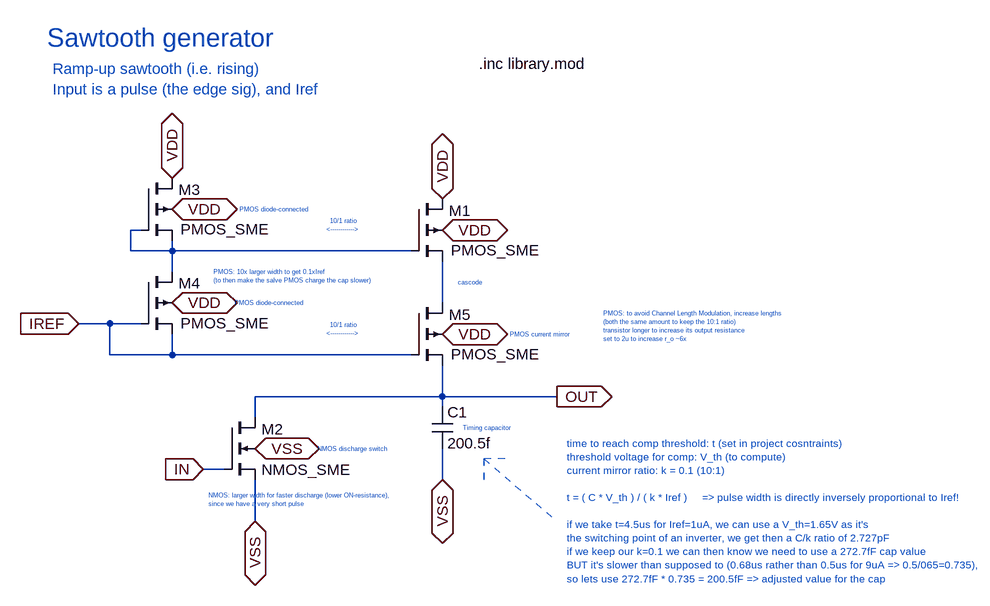
[diagram p0: schematic my_sawtooth_gen.bk2.asc]
my_sawtooth_gen.bk2.asc, the LTspice schematic file:
Version 4.1
SHEET 1 1580 1548
WIRE 48 208 32 208
WIRE 32 240 32 208
WIRE 96 240 96 224
WIRE 96 240 32 240
WIRE 464 240 96 240
WIRE 96 272 96 240
WIRE 512 320 512 256
WIRE 0 352 -48 352
WIRE 48 352 0 352
WIRE 0 400 0 352
WIRE 96 400 96 368
WIRE 96 400 0 400
WIRE 464 400 96 400
WIRE 512 464 512 416
WIRE 512 464 224 464
WIRE 688 464 512 464
WIRE 512 480 512 464
WIRE 224 496 224 464
WIRE 176 576 144 576
WIRE 512 592 512 544
WIRE 224 656 224 592
FLAG 144 576 IN
IOPIN 144 576 In
FLAG -48 352 IREF
IOPIN -48 352 In
FLAG 688 464 OUT
IOPIN 688 464 Out
FLAG 96 320 VDD
IOPIN 96 320 BiDir
FLAG 512 208 VDD
IOPIN 512 208 BiDir
FLAG 512 592 VSS
IOPIN 512 592 BiDir
FLAG 224 656 VSS
IOPIN 224 656 BiDir
FLAG 224 544 VSS
IOPIN 224 544 BiDir
FLAG 96 176 VDD
IOPIN 96 176 BiDir
FLAG 512 368 VDD
IOPIN 512 368 BiDir
FLAG 512 160 VDD
IOPIN 512 160 BiDir
FLAG 96 128 VDD
IOPIN 96 128 BiDir
SYMBOL pmos4 464 160 R0
WINDOW 0 58 18 Left 2
WINDOW 3 61 79 Left 2
SYMATTR InstName M1
SYMATTR Value PMOS_SME
SYMATTR Value2 l=5u w=1u
SYMBOL cap 496 480 R0
SYMATTR InstName C1
SYMATTR Value 200.5f
SYMBOL nmos4 176 496 R0
WINDOW 0 58 18 Left 2
WINDOW 3 58 81 Left 2
SYMATTR InstName M2
SYMATTR Value NMOS_SME
SYMATTR Value2 l=0.35u w=1.8u
SYMBOL pmos4 48 128 R0
WINDOW 0 58 18 Left 2
WINDOW 3 61 79 Left 2
SYMATTR InstName M3
SYMATTR Value PMOS_SME
SYMATTR Value2 l=5u w=10u
SYMBOL pmos4 48 272 R0
WINDOW 0 58 18 Left 2
WINDOW 3 61 79 Left 2
SYMATTR InstName M4
SYMATTR Value PMOS_SME
SYMATTR Value2 l=5u w=10u
SYMBOL pmos4 464 320 R0
WINDOW 0 58 18 Left 2
WINDOW 3 61 79 Left 2
SYMATTR InstName M5
SYMATTR Value PMOS_SME
SYMATTR Value2 l=5u w=1u
TEXT -96 -88 Left 4 ;Sawtooth generator
TEXT -88 -40 Left 2 ;Ramp-up sawtooth (i.e. rising)\nInput is a pulse (the edge sig), and Iref
TEXT 616 368 Left 0 ;PMOS current mirror
TEXT 544 512 Left 0 ;Timing capacitor
TEXT 320 544 Left 0 ;NMOS discharge switch
TEXT 192 320 Left 0 ;PMOS diode-connected
TEXT 568 -48 Left 2 !.inc library.mod
TEXT 152 616 Left 0 ;NMOS: larger width for faster discharge (lower ON-resistance),\nsince we have a very short pulse
TEXT 160 272 Left 0 ;PMOS: 10x larger width to get 0.1xIref\n(to then make the salve PMOS charge the cap slower)
TEXT 760 336 Left 0 ;PMOS: to avoid Channel Length Modulation, increase lengths\n(both the same amount to keep the 10:1 ratio)\ntransistor longer to increase its output resistance\nset to 2u to increase r_o ~6x
TEXT 704 536 Left 1 ;time to reach comp threshold: t (set in project cosntraints)\nthreshold voltage for comp: V_th (to compute)\ncurrent mirror ratio: k = 0.1 (10:1)\n \nt = ( C * V_th ) / ( k * Iref )     => pulse width is directly inversely proportional to Iref!\n \nif we take t=4.5us for Iref=1uA, we can use a V_th=1.65V as it's\nthe switching point of an inverter, we get then a C/k ratio of 2.727pF\nif we keep our k=0.1 we can then know we need to use a 272.7fF cap value\nBUT it's slower than supposed to (0.68us rather than 0.5us for 9uA => 0.5/065=0.735),\nso lets use 272.7fF * 0.735 = 200.5fF => adjusted value for the cap
TEXT 360 200 Center 0 ;10/1 ratio\n<------------>
TEXT 200 176 Left 0 ;PMOS diode-connected
TEXT 360 360 Center 0 ;10/1 ratio\n<------------>
TEXT 536 288 Left 0 ;cascode
LINE Normal 576 560 688 656 1
LINE Normal 576 592 576 560 1
LINE Normal 576 560 576 592 2
LINE Normal 608 560 576 560 1

The netlist it stands for:
* my_sawtooth_gen.bk2.asc
M1 VDD N001 N002 VDD PMOS_SME l=5u w=1u
C1 OUT VSS 200.5f
M2 OUT IN VSS VSS NMOS_SME l=0.35u w=1.8u
M3 VDD N001 N001 VDD PMOS_SME l=5u w=10u
M4 N001 IREF IREF VDD PMOS_SME l=5u w=10u
M5 N002 IREF OUT VDD PMOS_SME l=5u w=1u
.model NMOS NMOS
.model PMOS PMOS
.lib standard.mos
* Sawtooth generator
* Ramp-up sawtooth (i.e. rising)
* Input is a pulse (the edge sig), and Iref
* PMOS current mirror
* Timing capacitor
* NMOS discharge switch
* PMOS diode-connected
.inc library.mod
* NMOS: larger width for faster discharge (lower ON-resistance),
* since we have a very short pulse
* PMOS: 10x larger width to get 0.1xIref
* (to then make the salve PMOS charge the cap slower)
* PMOS: to avoid Channel Length Modulation, increase lengths
* (both the same amount to keep the 10:1 ratio)
* transistor longer to increase its output resistance
* set to 2u to increase r_o ~6x
* time to reach comp threshold: t (set in project cosntraints)
* threshold voltage for comp: V_th (to compute)
* current mirror ratio: k = 0.1 (10:1)
* t = ( C * V_th ) / ( k * Iref )     => pulse width is directly inversely proportional to Iref!
* if we take t=4.5us for Iref=1uA, we can use a V_th=1.65V as it's
* the switching point of an inverter, we get then a C/k ratio of 2.727pF
* if we keep our k=0.1 we can then know we need to use a 272.7fF cap value
* BUT it's slower than supposed to (0.68us rather than 0.5us for 9uA => 0.5/065=0.735),
* so lets use 272.7fF * 0.735 = 200.5fF => adjusted value for the cap
* 10/1 ratio
* <------------>
* PMOS diode-connected
* 10/1 ratio
* <------------>
* cascode
.backanno
.end